# Altium schematic sheet HIGHSPEED_v0_BATT-CHARGER.SchDoc
size A
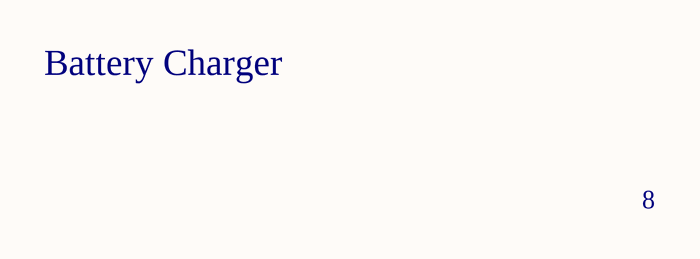
[diagram p0: HIGHSPEED_v0_BATT-CHARGER.SchDoc]

## Notes on the sheet
- Battery Charger
- 8